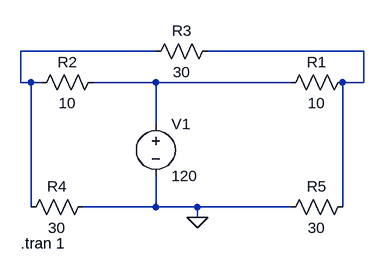
[diagram p0: schematic Ex_03_75.asc]
Ex_03_75.asc, the LTspice schematic file:
Version 4.1
SHEET 1 880 680
WIRE 16 -16 -192 -16
WIRE 336 -16 96 -16
WIRE -192 32 -192 -16
WIRE -176 32 -192 32
WIRE -160 32 -176 32
WIRE 16 32 -80 32
WIRE 224 32 16 32
WIRE 336 32 336 -16
WIRE 336 32 304 32
WIRE 16 96 16 32
WIRE -176 224 -176 32
WIRE 16 224 16 176
WIRE 16 224 -96 224
WIRE 80 224 16 224
WIRE 224 224 80 224
WIRE 304 224 304 32
WIRE 80 240 80 224
FLAG 80 240 0
SYMBOL voltage 16 80 R0
SYMATTR InstName V1
SYMATTR Value 120
SYMBOL res 320 16 R90
WINDOW 0 0 56 VBottom 2
WINDOW 3 32 56 VTop 2
SYMATTR InstName R1
SYMATTR Value 10
SYMBOL res -176 48 R270
WINDOW 0 32 56 VTop 2
WINDOW 3 0 56 VBottom 2
SYMATTR InstName R2
SYMATTR Value 10
SYMBOL res 112 -32 R90
WINDOW 0 0 56 VBottom 2
WINDOW 3 32 56 VTop 2
SYMATTR InstName R3
SYMATTR Value 30
SYMBOL res -80 208 R90
WINDOW 0 0 56 VBottom 2
WINDOW 3 32 56 VTop 2
SYMATTR InstName R4
SYMATTR Value 30
SYMBOL res 320 208 R90
WINDOW 0 0 56 VBottom 2
WINDOW 3 32 56 VTop 2
SYMATTR InstName R5
SYMATTR Value 30
TEXT -192 280 Left 2 !.tran 1

The netlist it stands for:
* Ex_03_75.asc
V1 N003 0 120
R1 N002 N003 10
R2 N001 N003 10
R3 N002 N001 30
R4 0 N001 30
R5 N002 0 30
.tran 1
.backanno
.end